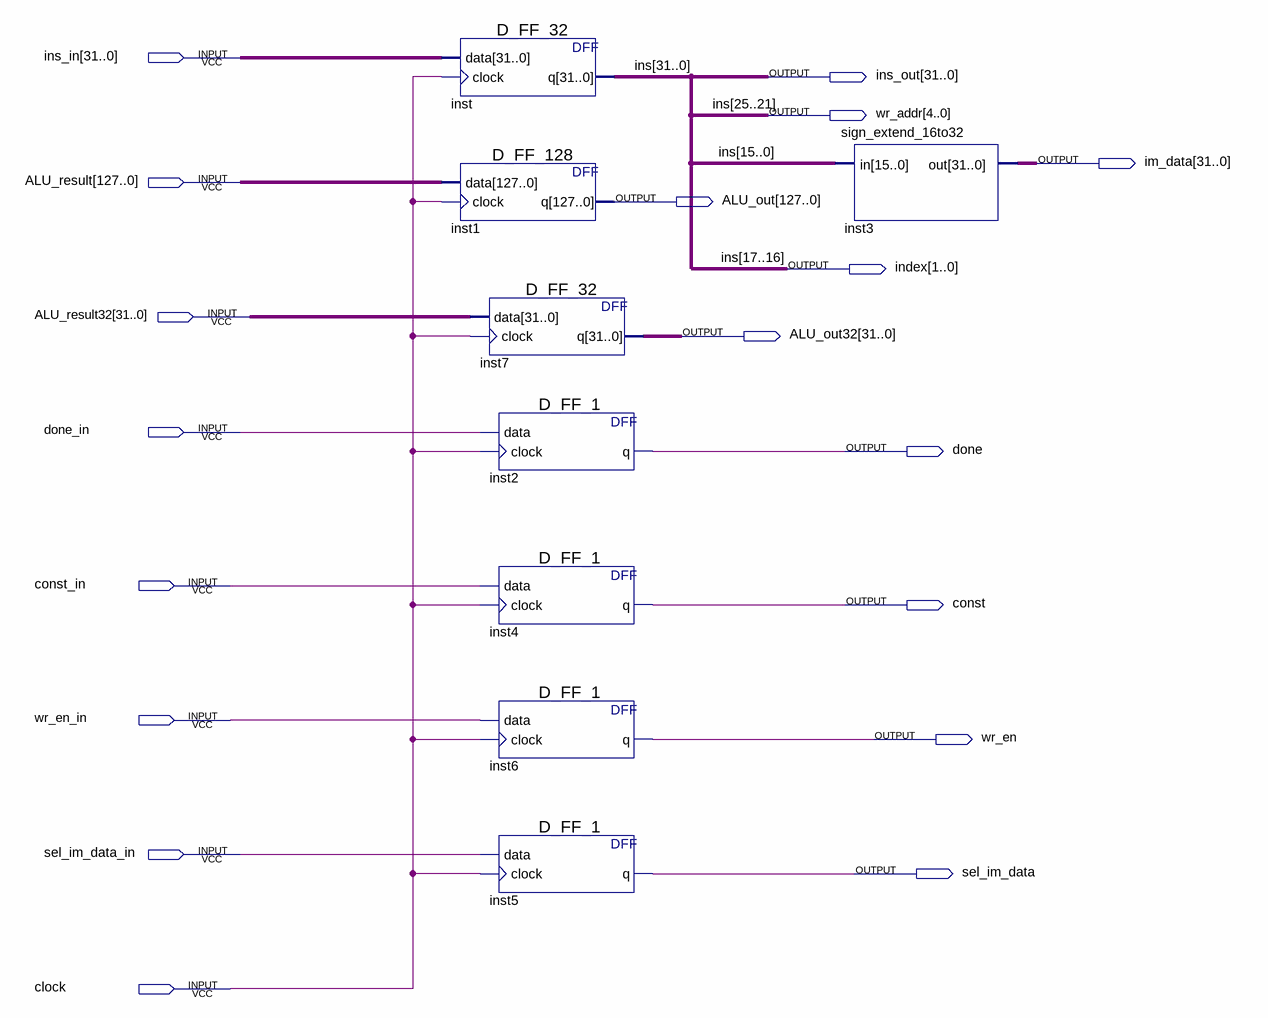
[diagram p0: schematic sheet]
// Quartus schematic CO_EX_WB.bdf as structural Verilog: 8 symbols, 18 pins
module CO_EX_WB (
  input  [31:0] ins_in,
  input  [127:0] ALU_result,
  input  [31:0] ALU_result32,
  input  done_in,
  input  const_in,
  input  wr_en_in,
  input  sel_im_data_in,
  input  clock,
  output [31:0] ins_out,
  output [4:0] wr_addr,
  output [31:0] im_data,
  output [127:0] ALU_out,
  output [1:0] index,
  output [31:0] ALU_out32,
  output done,
  output \const ,
  output wr_en,
  output sel_im_data
);

  D_FF_32 inst (.data(ins_in), .clock(clock), .q({ins_out[31:18], index, ins_out[15:0]}));
  D_FF_128 inst1 (.data(ALU_result), .clock(clock), .q(ALU_out));
  D_FF_32 inst7 (.data(ALU_result32), .clock(clock), .q(ALU_out32));
  D_FF_1 inst2 (.data(done_in), .clock(clock), .q(done));
  D_FF_1 inst4 (.data(const_in), .clock(clock), .q(\const ));
  D_FF_1 inst6 (.data(wr_en_in), .clock(clock), .q(wr_en));
  D_FF_1 inst5 (.data(sel_im_data_in), .clock(clock), .q(sel_im_data));
  sign_extend_16to32 inst3 (.in(ins_out[15:0]), .out(im_data));

  assign ins_out[17:16] = index;
  assign wr_addr = ins_out[25:21];

  // Other names for the same wires on the sheet: ins[31:0] = {ins_out[31:18], index, ins_out[15:0]}
endmodule
